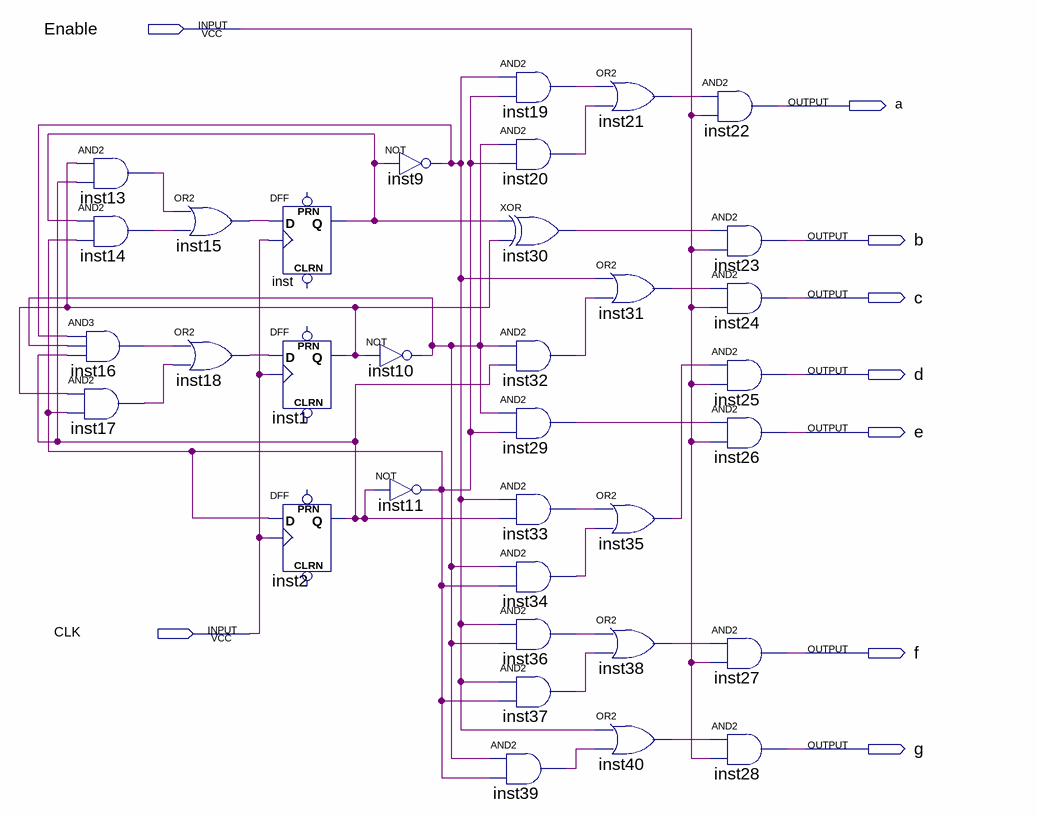
[diagram p0: schematic sheet]
// Quartus schematic Green_FND.bdf as structural Verilog: 34 symbols, 9 pins
module Green_FND (
  input  Enable,
  input  CLK,
  output a,
  output b,
  output c,
  output d,
  output e,
  output f,
  output g
);

  wire inst1_q, inst2_q, inst9_out, inst10_out, inst11_out, inst13_out, inst14_out, inst15_out, inst16_out,
       inst17_out, inst18_out, inst19_out, inst20_out, inst21_out, inst29_out, inst30_out, inst31_out,
       inst32_out, inst33_out, inst34_out, inst35_out, inst36_out, inst37_out, inst38_out, inst39_out,
       inst40_out, inst_q;

  and inst13 (inst13_out, inst1_q, inst2_q);
  and inst14 (inst14_out, inst_q, inst11_out);
  and inst16 (inst16_out, inst9_out, inst10_out, inst2_q);
  and inst17 (inst17_out, inst1_q, inst11_out);
  or inst15 (inst15_out, inst13_out, inst14_out);
  or inst18 (inst18_out, inst16_out, inst17_out);
  DFF inst (.CLK(CLK), .D(inst15_out), .Q(inst_q));  // open: CLRN, PRN
  DFF inst1 (.CLK(CLK), .D(inst18_out), .Q(inst1_q));  // open: CLRN, PRN
  DFF inst2 (.CLK(CLK), .D(inst11_out), .Q(inst2_q));  // open: CLRN, PRN
  not inst9 (inst9_out, inst_q);
  not inst10 (inst10_out, inst1_q);
  not inst11 (inst11_out, inst2_q);
  and inst39 (inst39_out, inst10_out, inst11_out);
  and inst19 (inst19_out, inst9_out, inst11_out);
  and inst20 (inst20_out, inst10_out, inst11_out);
  xor inst30 (inst30_out, inst_q, inst1_q);
  and inst32 (inst32_out, inst10_out, inst2_q);
  and inst29 (inst29_out, inst10_out, inst11_out);
  and inst33 (inst33_out, inst9_out, inst2_q);
  and inst34 (inst34_out, inst10_out, inst11_out);
  and inst36 (inst36_out, inst9_out, inst10_out);
  and inst37 (inst37_out, inst9_out, inst11_out);
  or inst21 (inst21_out, inst19_out, inst20_out);
  or inst31 (inst31_out, inst9_out, inst32_out);
  or inst35 (inst35_out, inst33_out, inst34_out);
  or inst38 (inst38_out, inst36_out, inst37_out);
  or inst40 (inst40_out, inst9_out, inst39_out);
  and inst22 (a, inst21_out, Enable);
  and inst23 (b, inst30_out, Enable);
  and inst24 (c, inst31_out, Enable);
  and inst25 (d, inst35_out, Enable);
  and inst26 (e, inst29_out, Enable);
  and inst27 (f, inst38_out, Enable);
  and inst28 (g, inst40_out, Enable);
endmodule
